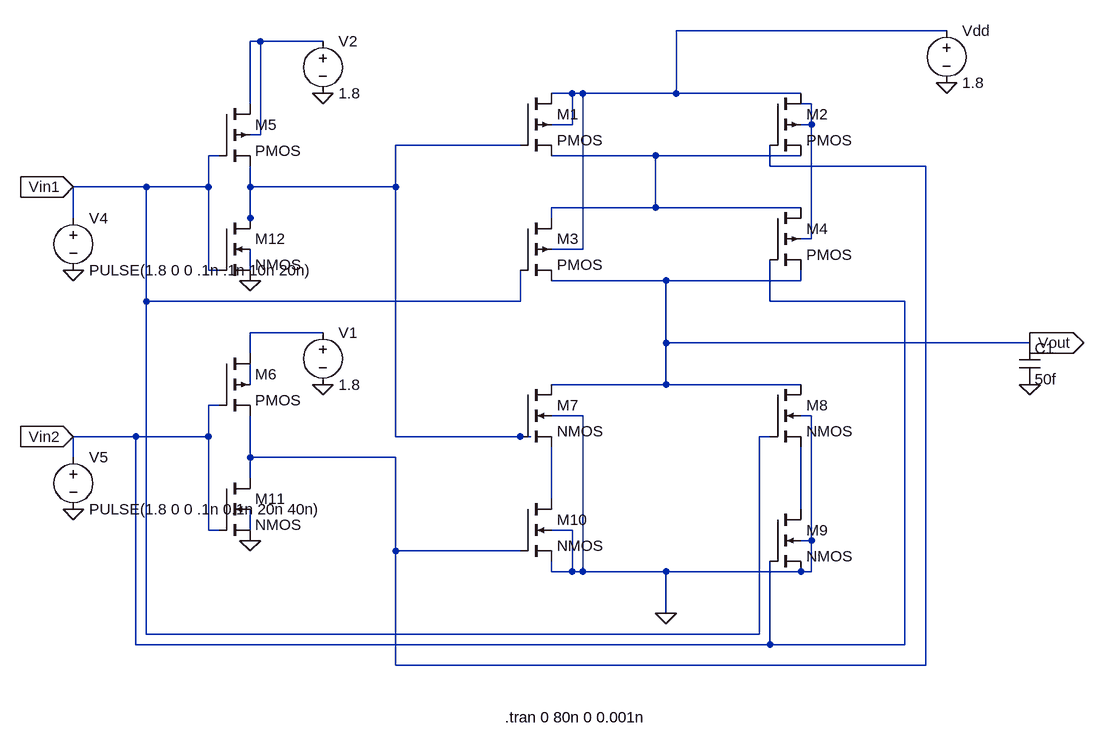
[diagram p0: schematic xor.asc]
xor.asc, the LTspice schematic file:
Version 4
SHEET 1 912 896
WIRE 672 -176 256 -176
WIRE -384 -160 -400 -160
WIRE -288 -160 -384 -160
WIRE 96 -80 64 -80
WIRE 112 -80 96 -80
WIRE 256 -80 256 -176
WIRE 256 -80 112 -80
WIRE 448 -80 256 -80
WIRE -400 -64 -400 -160
WIRE 464 -64 448 -64
WIRE 96 -32 96 -80
WIRE 96 -32 64 -32
WIRE 464 -32 464 -64
WIRE 464 -32 448 -32
WIRE -384 -16 -384 -160
WIRE -384 -16 -400 -16
WIRE 16 0 -176 0
WIRE -448 16 -464 16
WIRE 224 16 64 16
WIRE 448 16 224 16
WIRE 400 32 400 0
WIRE 640 32 400 32
WIRE -560 64 -672 64
WIRE -464 64 -464 16
WIRE -464 64 -560 64
WIRE -400 64 -400 32
WIRE -176 64 -176 0
WIRE -176 64 -400 64
WIRE 224 96 224 16
WIRE 224 96 64 96
WIRE 448 96 224 96
WIRE -672 112 -672 64
WIRE -400 112 -400 64
WIRE 64 112 64 96
WIRE -400 128 -400 112
WIRE 464 144 464 -32
WIRE 464 144 448 144
WIRE 112 160 112 -80
WIRE 112 160 64 160
WIRE -464 192 -464 64
WIRE -448 192 -464 192
WIRE -400 192 -400 160
WIRE 240 208 64 208
WIRE 448 208 448 192
WIRE 448 208 240 208
WIRE -560 240 -560 64
WIRE 16 240 16 192
WIRE 16 240 -560 240
WIRE 400 240 400 176
WIRE 608 240 400 240
WIRE -288 288 -400 288
WIRE 240 304 240 208
WIRE 800 304 240 304
WIRE -400 320 -400 288
WIRE -400 368 -400 336
WIRE 240 368 240 304
WIRE 240 368 64 368
WIRE 448 368 240 368
WIRE -448 400 -464 400
WIRE 112 416 64 416
WIRE 464 416 448 416
WIRE -576 448 -672 448
WIRE -464 448 -464 400
WIRE -464 448 -576 448
WIRE -176 448 -176 64
WIRE 16 448 -176 448
WIRE 32 448 16 448
WIRE 400 448 384 448
WIRE -672 480 -672 448
WIRE -400 480 -400 416
WIRE -176 480 -400 480
WIRE -400 512 -400 480
WIRE 64 544 64 464
WIRE 448 560 448 464
WIRE -464 592 -464 448
WIRE -448 592 -464 592
WIRE -400 592 -400 560
WIRE 96 592 64 592
WIRE 464 608 464 416
WIRE 464 608 448 608
WIRE -176 624 -176 480
WIRE 16 624 -176 624
WIRE 64 656 64 640
WIRE 96 656 96 592
WIRE 96 656 64 656
WIRE 112 656 112 416
WIRE 112 656 96 656
WIRE 240 656 112 656
WIRE 448 656 240 656
WIRE 464 656 464 608
WIRE 464 656 448 656
WIRE 240 720 240 656
WIRE -560 752 -560 240
WIRE 384 752 384 448
WIRE 384 752 -560 752
WIRE -576 768 -576 448
WIRE 400 768 400 640
WIRE 400 768 -576 768
WIRE 608 768 608 240
WIRE 608 768 400 768
WIRE -176 800 -176 624
WIRE 640 800 640 32
WIRE 640 800 -176 800
FLAG 240 720 0
FLAG 672 -96 0
FLAG -400 608 0
FLAG -400 208 0
FLAG -288 -80 0
FLAG -288 368 0
FLAG -672 560 0
FLAG -672 192 0
FLAG 800 368 0
FLAG 800 304 Vout
IOPIN 800 304 Out
FLAG -672 64 Vin1
IOPIN -672 64 In
FLAG -672 448 Vin2
IOPIN -672 448 In
SYMBOL pmos4 16 -80 R0
SYMATTR InstName M1
SYMATTR Value2 l=180nm w=810nm
SYMBOL pmos4 400 -80 R0
SYMATTR InstName M2
SYMATTR Value2 l=180nm w=810nm
SYMBOL pmos4 16 112 R0
SYMATTR InstName M3
SYMATTR Value2 l=180nm w=810nm
SYMBOL pmos4 400 96 R0
SYMATTR InstName M4
SYMATTR Value2 l=180nm w=810nm
SYMBOL pmos4 -448 -64 R0
SYMATTR InstName M5
SYMATTR Value2 l=180nm w=810nm
SYMBOL pmos4 -448 320 R0
SYMATTR InstName M6
SYMATTR Value2 l=180nm w=810nm
SYMBOL nmos4 16 368 R0
SYMATTR InstName M7
SYMATTR Value2 l=180nm w=270nm
SYMBOL nmos4 400 368 R0
SYMATTR InstName M8
SYMATTR Value2 l=180nm w=270nm
SYMBOL nmos4 400 560 R0
SYMATTR InstName M9
SYMATTR Value2 l=180nm w=270nm
SYMBOL nmos4 16 544 R0
SYMATTR InstName M10
SYMATTR Value2 l=180nm w=270nm
SYMBOL nmos4 -448 512 R0
SYMATTR InstName M11
SYMATTR Value2 l=180nm w=270nm
SYMBOL nmos4 -448 112 R0
SYMATTR InstName M12
SYMATTR Value2 l=180nm w=270nm
SYMBOL voltage 672 -192 R0
WINDOW 123 0 0 Left 0
WINDOW 39 0 0 Left 0
SYMATTR InstName Vdd
SYMATTR Value 1.8
SYMBOL voltage -288 -176 R0
WINDOW 123 0 0 Left 0
WINDOW 39 0 0 Left 0
SYMATTR InstName V2
SYMATTR Value 1.8
SYMBOL voltage -672 96 R0
WINDOW 123 0 0 Left 0
WINDOW 39 0 0 Left 0
SYMATTR InstName V4
SYMATTR Value PULSE(1.8 0 0 .1n .1n 10n 20n)
SYMBOL voltage -672 464 R0
WINDOW 123 0 0 Left 0
WINDOW 39 0 0 Left 0
SYMATTR InstName V5
SYMATTR Value PULSE(1.8 0 0 .1n 0.1n 20n 40n)
SYMBOL cap 784 304 R0
SYMATTR InstName C1
SYMATTR Value 50f
SYMBOL voltage -288 272 R0
WINDOW 123 0 0 Left 0
WINDOW 39 0 0 Left 0
SYMATTR InstName V1
SYMATTR Value 1.8
TEXT -8 880 Left 2 !.tran 0 80n 0 0.001n

The netlist it stands for:
* xor.asc
M1 N001 N004 N005 N001 PMOS l=180nm w=810nm
M2 N001 N006 N005 N003 PMOS l=180nm w=810nm
M3 N005 Vin1 Vout N001 PMOS l=180nm w=810nm
M4 N005 Vin2 Vout N003 PMOS l=180nm w=810nm
M5 N002 Vin1 N004 N002 PMOS l=180nm w=810nm
M6 N008 Vin2 N006 N009 PMOS l=180nm w=810nm
M7 Vout N004 N010 0 NMOS l=180nm w=270nm
M8 Vout Vin1 N011 0 NMOS l=180nm w=270nm
M9 N011 Vin2 0 0 NMOS l=180nm w=270nm
M10 N010 N006 0 0 NMOS l=180nm w=270nm
M11 N006 Vin2 0 N012 NMOS l=180nm w=270nm
M12 N004 Vin1 0 N007 NMOS l=180nm w=270nm
Vdd N001 0 1.8
V2 N002 0 1.8
V4 Vin1 0 PULSE(1.8 0 0 .1n .1n 10n 20n)
V5 Vin2 0 PULSE(1.8 0 0 .1n 0.1n 20n 40n)
C1 Vout 0 50f
V1 N008 0 1.8
.model NMOS NMOS
.model PMOS PMOS
.lib standard.mos
.tran 0 80n 0 0.001n
.backanno
.end